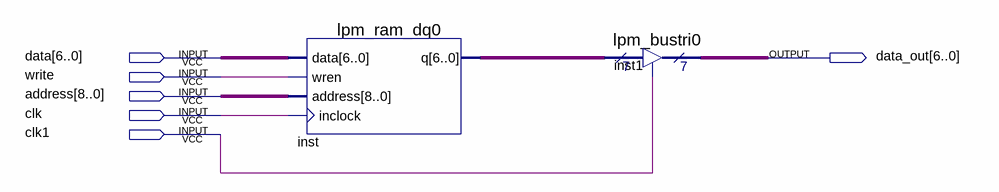
[diagram p0: schematic sheet]
// Quartus schematic ram.bdf as structural Verilog: 2 symbols, 6 pins
module ram (
  input  [6:0] data,
  input  write,
  input  [8:0] address,
  input  clk,
  input  clk1,
  output [6:0] data_out
);

  wire [6:0] inst_q;

  lpm_ram_dq0 inst (.data(data), .wren(write), .address(address), .inclock(clk), .q(inst_q));
  lpm_bustri0 inst1 (.enabledt(clk1), .data(inst_q), .tridata(data_out));
endmodule
